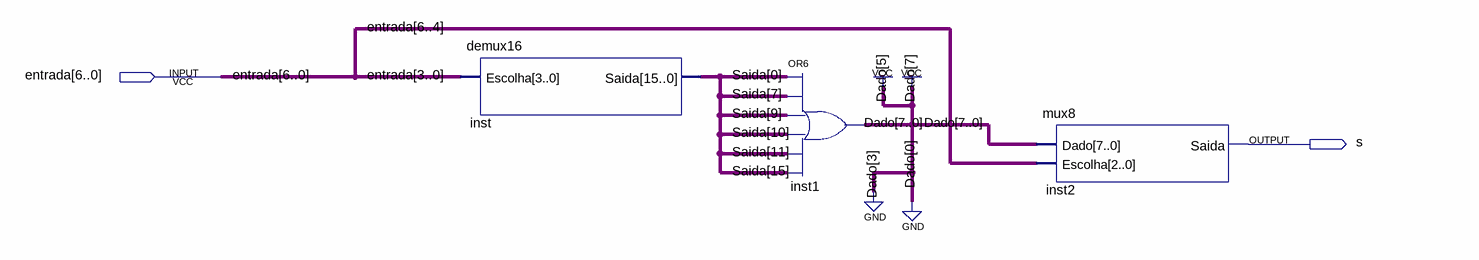
[diagram p0: schematic sheet]
// Quartus schematic pretres.bdf as structural Verilog: 3 symbols, 2 pins
module pretres (
  input  [6:0] entrada,
  output s
);

  wire [7:0] Dado;
  wire [15:0] Saida;

  demux16 inst (.Escolha(entrada[3:0]), .Saida({Saida[15], Saida[11:9], Saida[7], Saida[0]}));
  assign Dado = {8{Saida[0]}} | {8{Saida[7]}} | {8{Saida[9]}} | {8{Saida[10]}} | {8{Saida[11]}} | {8{Saida[15]}};  // OR6 inst1, 8 bits wide
  mux8 inst2 (.Dado(Dado), .Escolha(entrada[6:4]), .Saida(s));
  // also tied to GND on the sheet: Dado[3]
  // also tied to VCC on the sheet: {Dado[5], Dado[7]}
endmodule
